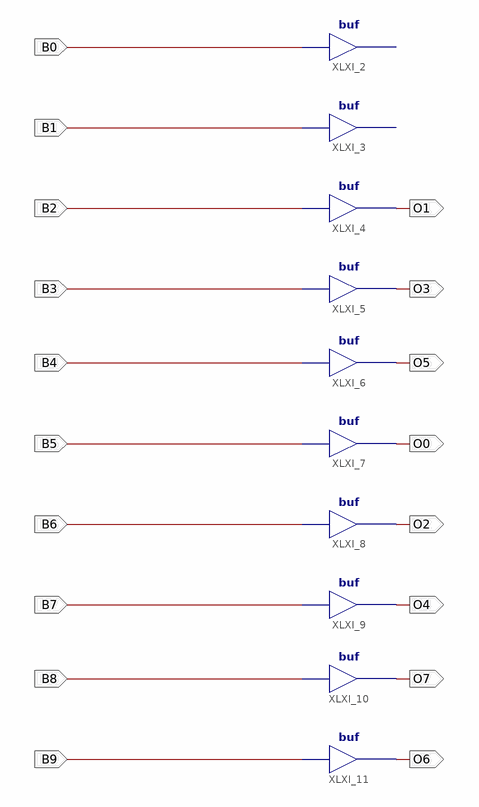
[diagram p0: schematic sheet 1]
// Xilinx ISE schematic P8.sch (xc9500xl) as structural Verilog: 10 symbols, 18 ports
module P8 (
  input  B0,
  input  B1,
  input  B2,
  input  B3,
  input  B4,
  input  B5,
  input  B6,
  input  B7,
  input  B8,
  input  B9,
  output O1,
  output O3,
  output O5,
  output O0,
  output O2,
  output O4,
  output O7,
  output O6
);

  // buf XLXI_2 has open pins: I=B0, O=open
  // buf XLXI_3 has open pins: I=B1, O=open
  buf XLXI_4 (O1, B2);
  buf XLXI_5 (O3, B3);
  buf XLXI_6 (O5, B4);
  buf XLXI_7 (O0, B5);
  buf XLXI_8 (O2, B6);
  buf XLXI_9 (O4, B7);
  buf XLXI_10 (O7, B8);
  buf XLXI_11 (O6, B9);
endmodule
